# EAGLE schematic WashingMachine (EAGLE 7.1.0)

## Sheet 1 of 5
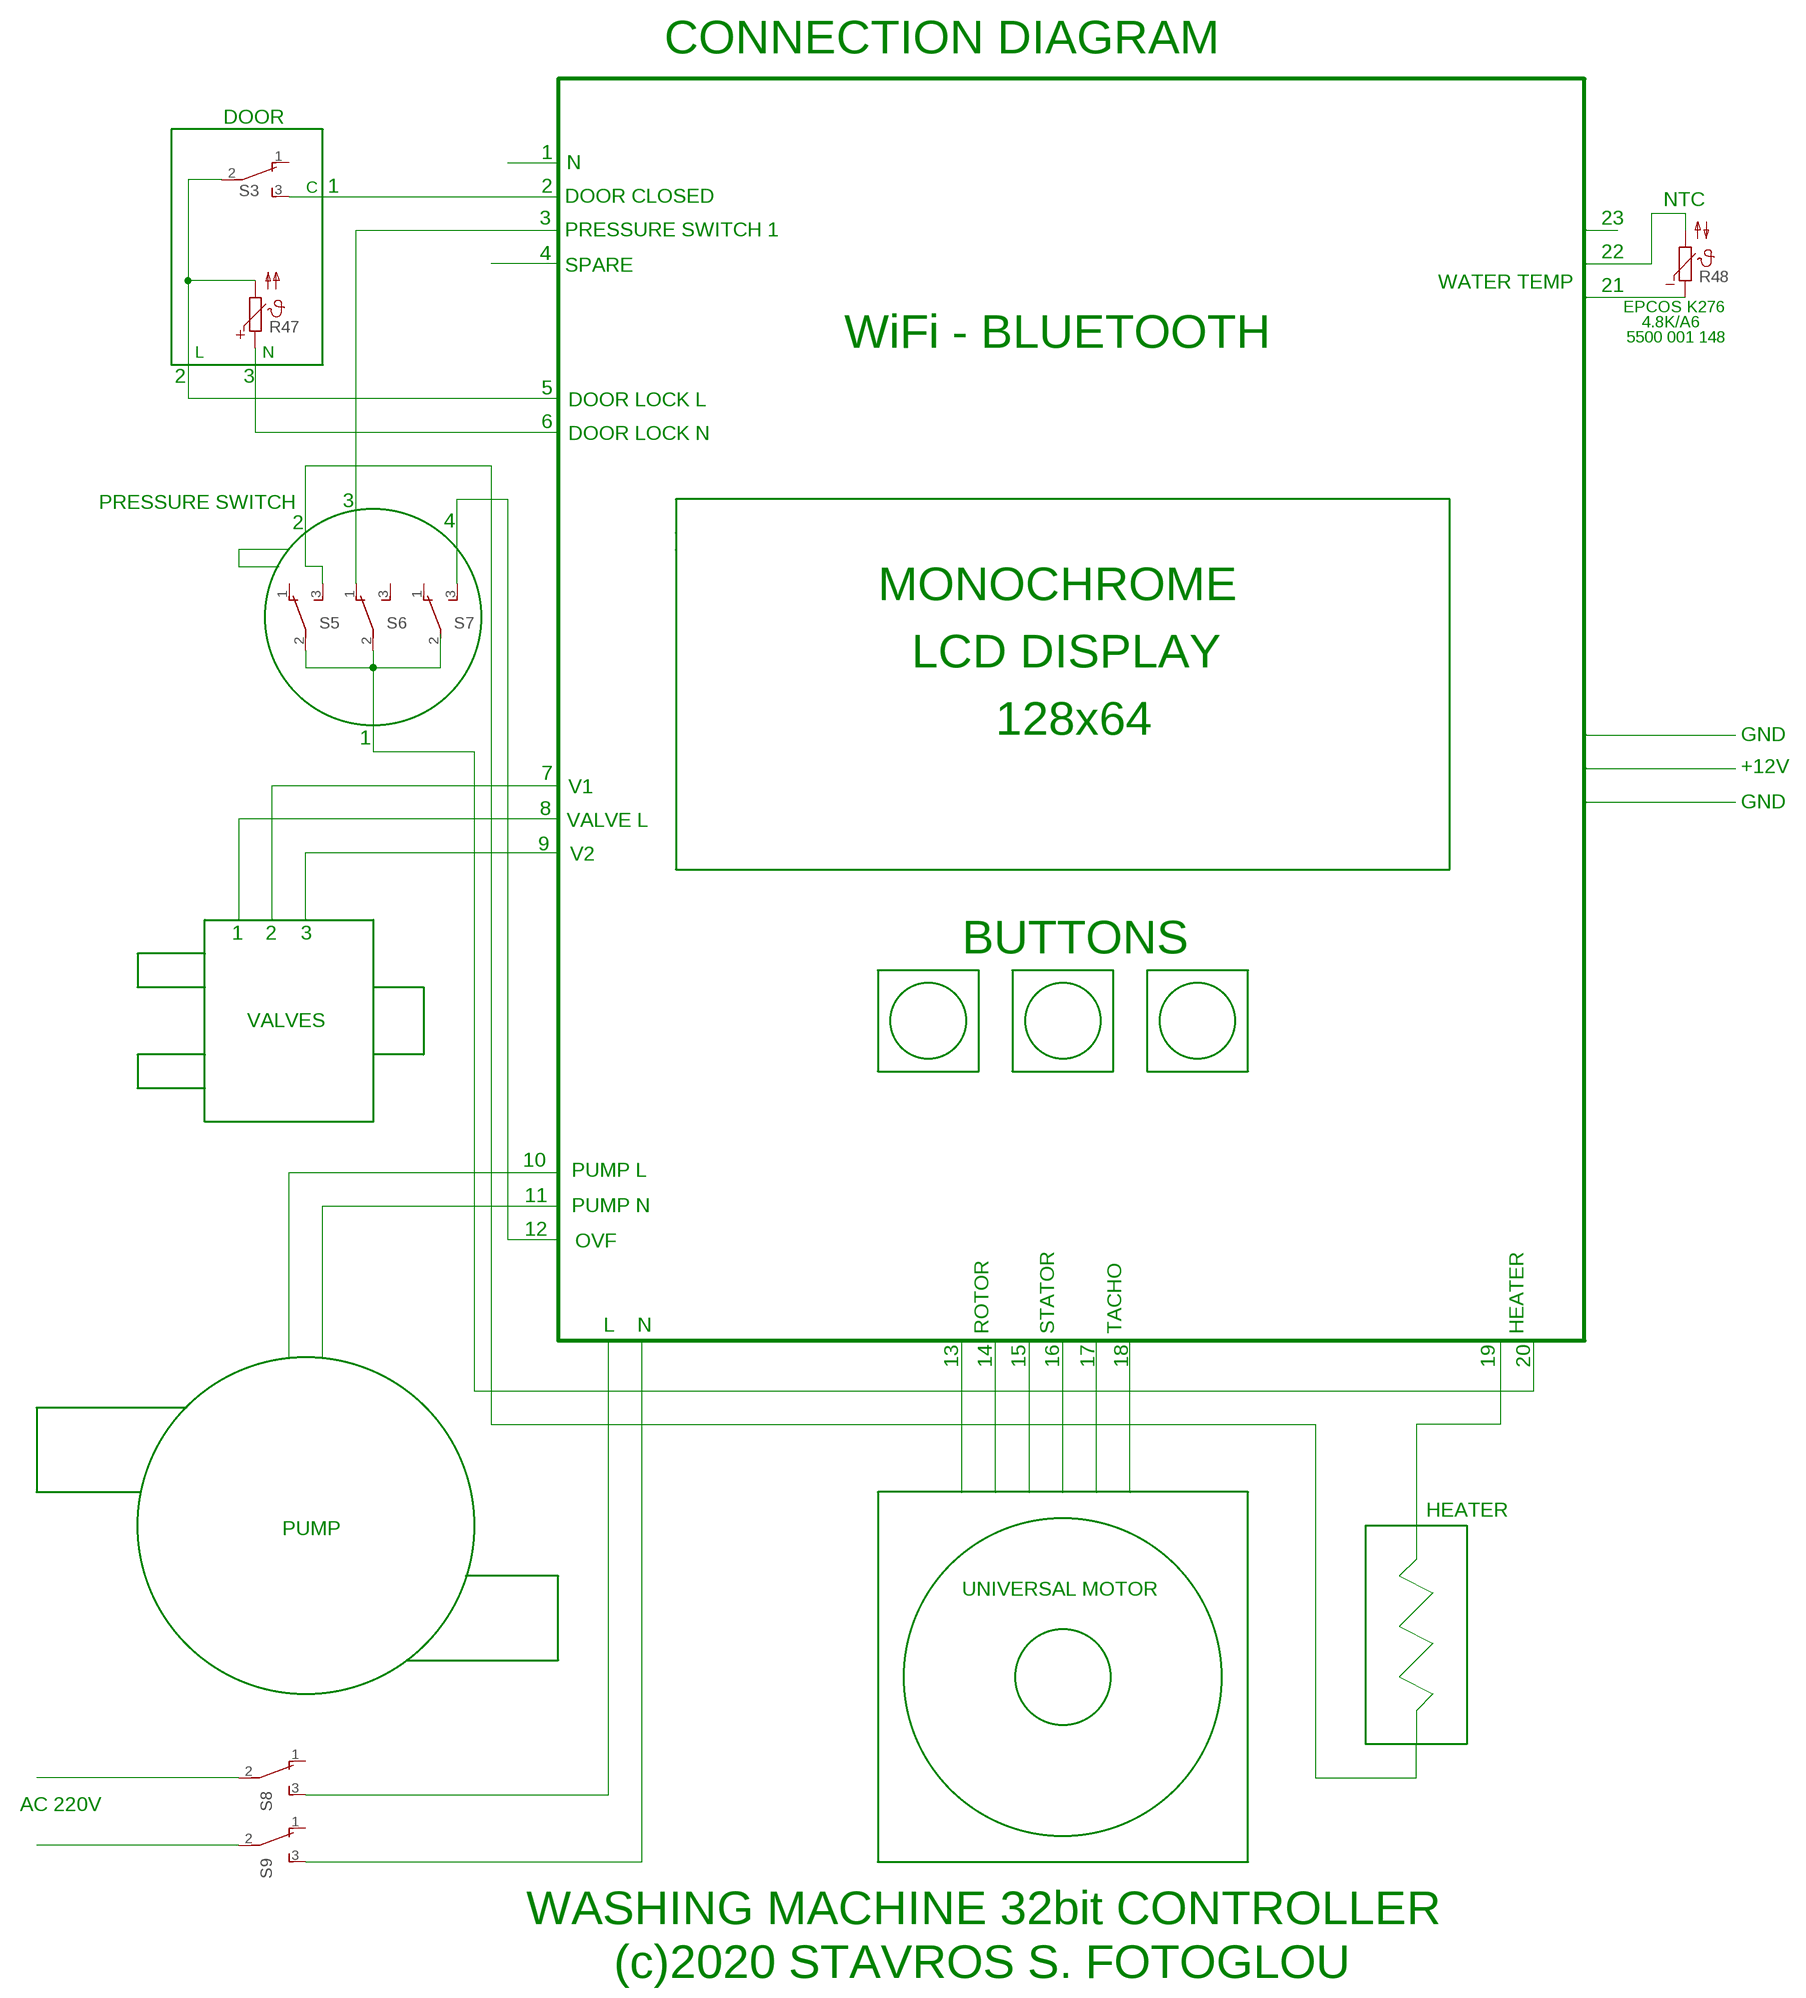
[diagram p0: schematic, sheet 1]

### Parts
R47  PTC679  [P679]
R48  NTC640-9  [N640]
S3  TL36WO  [TL3XWO]
S5  TL36WO  [TL3XWO]
S6  TL36WO  [TL3XWO]
S7  TL36WO  [TL3XWO]
S8  TL36WO  [TL3XWO]
S9  TL36WO  [TL3XWO]

### Nets
N$63: R47.1 R47.2 R48.1 R48.2 S3.2(P) S3.3(S) S5.2(P) S5.3(S) S6.1(O) S6.2(P) S7.2(P) S7.3(S) S8.3(S) S9.3(S)
N$128: S8.2(P)
N$134: S9.2(P)
Unconnected: S3.1(O) S5.1(O) S6.3(S) S7.1(O) S8.1(O) S9.1(O)

### Notes on the sheet
- CONNECTION DIAGRAM
- DOOR
- 1
- N
- C | 1 | 2
- DOOR CLOSED | NTC
- 3 | 23
- PRESSURE SWITCH 1
- 4 | 22
- SPARE
- WATER TEMP | 21
- EPCOS K276
- 4.8K/A6
- 5500 001 148
- WiFi - BLUETOOTH
- L | N
- 2 | 3
- 5
- DOOR LOCK L
- 6
- DOOR LOCK N
- PRESSURE SWITCH | 3
- 2 | 4
- MONOCHROME
- LCD DISPLAY
- 128x64
- 1 | GND
- +12V
- 7
- V1
- GND
- 8
- VALVE L
- 9
- V2
- 1 | 2 | 3
- BUTTONS
- VALVES
- 10
- PUMP L
- 11
- PUMP N
- 12
- OVF
- L | N | ROTOR | STATOR | TACHO | HEATER
- 13 | 14 | 15 | 16 | 17 | 18 | 19 | 20
- HEATER
- PUMP
- UNIVERSAL MOTOR
- AC 220V
- WASHING MACHINE 32bit CONTROLLER
- (c)2020 STAVROS S. FOTOGLOU

## Sheet 2 of 5
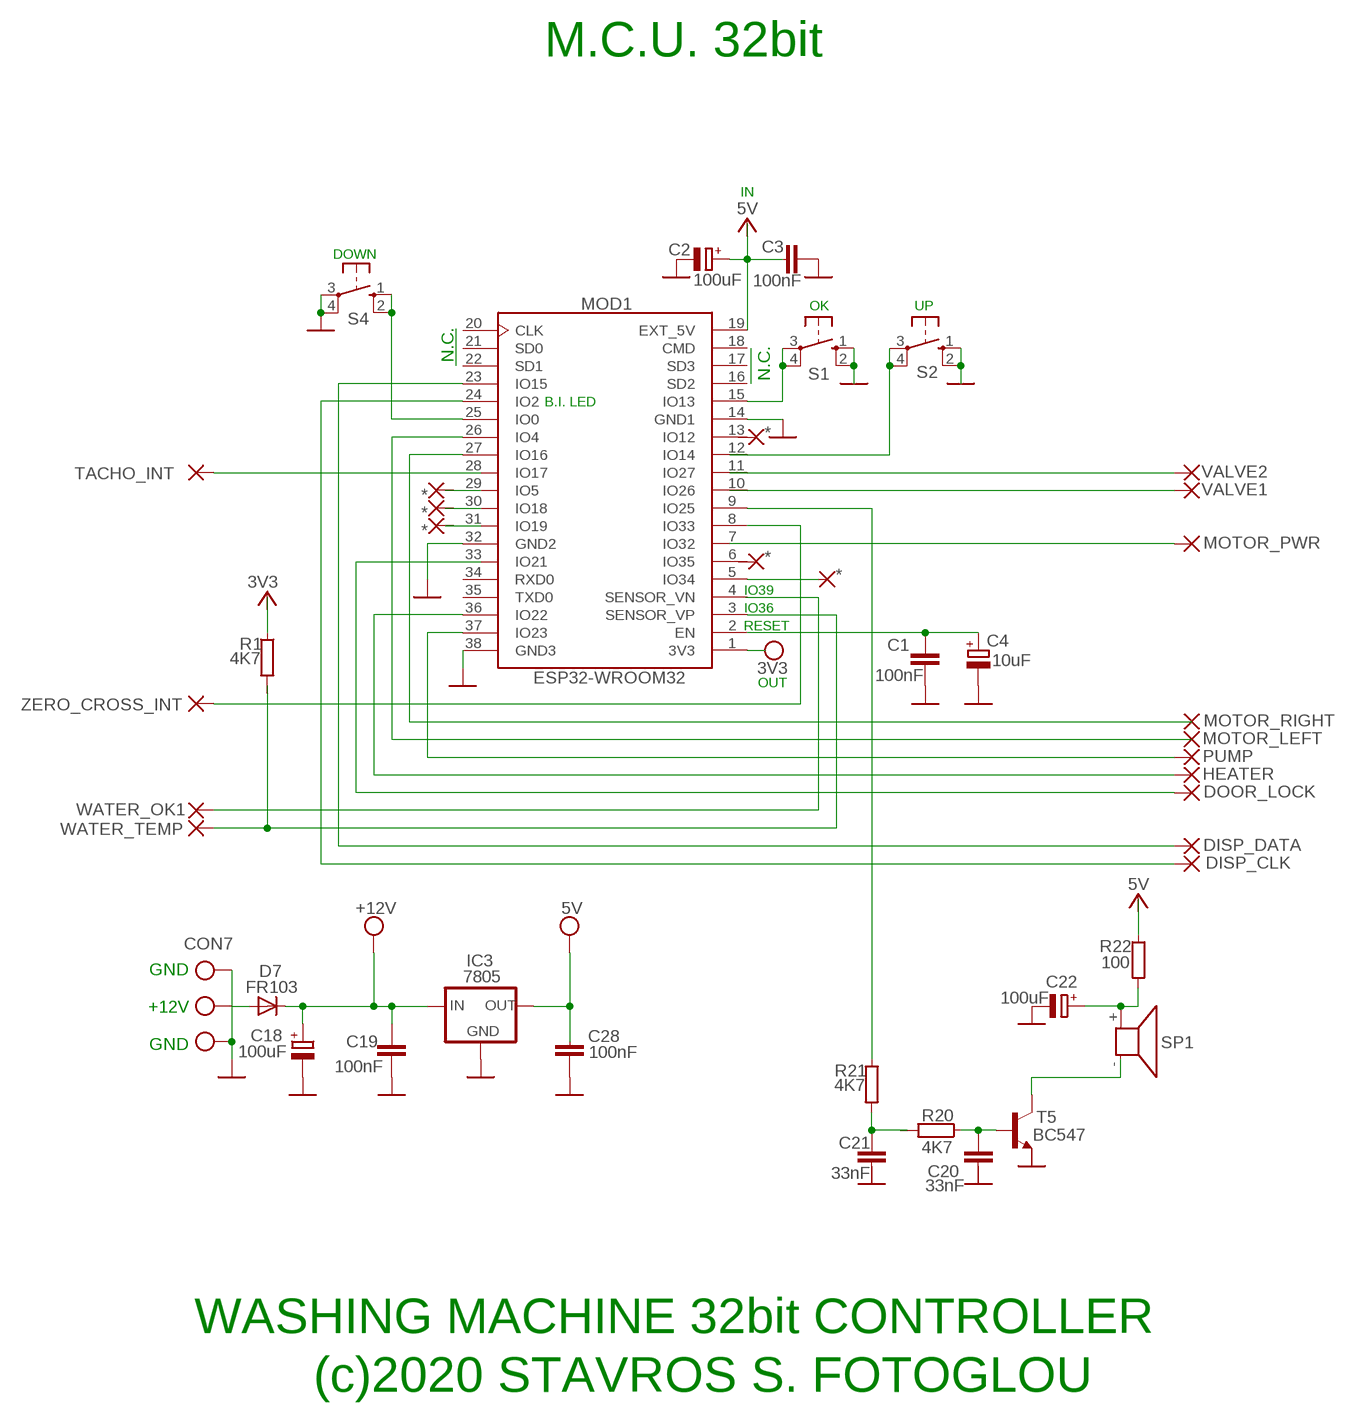
[diagram p1: schematic, sheet 2]

### Parts
C1  100nF  C2.5/2  [C2.5-2]
C2  100uF  CPOL-EUE5-6  [E5-6]
C3  100nF  C2.5/2  [C2.5-2]
C4  10uF  CPOL-EUE5-6  [E5-6]
C18  100uF  CPOL-EUE5-6  [E5-6]
C19  100nF  C2.5/2  [C2.5-2]
C20  33nF  C2.5/2  [C2.5-2]
C21  33nF  C2.5/2  [C2.5-2]
C22  100uF  CPOL-EUE5-6  [E5-6]
C28  100nF  C2.5/2  [C2.5-2]
D7  FR103  1N4004  [DO41-10]
IC3  7805  78XXL  [78XXL]
MOD1  ESP32-WROOM32  ESP32-DEVKITC-32U  [MODULE_ESP32-DEVKITC-32U]
PAD1  MOTOR_RIGHT  1,6/0,8  [1,6/0,8]
PAD2  MOTOR_LEFT  1,6/0,8  [1,6/0,8]
PAD3  TACHO_INT  1,6/0,8  [1,6/0,8]
PAD4  VALVE1  1,6/0,8  [1,6/0,8]
PAD5  VALVE2  1,6/0,8  [1,6/0,8]
PAD6  PUMP  1,6/0,8  [1,6/0,8]
PAD7  HEATER  1,6/0,8  [1,6/0,8]
PAD8  DOOR_LOCK  1,6/0,8  [1,6/0,8]
PAD9  WATER_OK1  1,6/0,8  [1,6/0,8]
PAD10  DISP_DATA  1,6/0,8  [1,6/0,8]
PAD11  DISP_CLK  1,6/0,8  [1,6/0,8]
PAD13  *  1,6/0,8  [1,6/0,8]
PAD14  *  1,6/0,8  [1,6/0,8]
PAD15  *  1,6/0,8  [1,6/0,8]
PAD24  *  1,6/0,8  [1,6/0,8]
PAD25  *  1,6/0,8  [1,6/0,8]
PAD30  WATER_TEMP  1,6/0,8  [1,6/0,8]
PAD31  ZERO_CROSS_INT  1,6/0,8  [1,6/0,8]
PAD32  MOTOR_PWR  1,6/0,8  [1,6/0,8]
PAD34  *  1,6/0,8  [1,6/0,8]
R1  4K7  R-EU_0204_7  [0204/7]
R20  4K7  R-EU_0204_7  [0204/7]
R21  4K7  R-EU_0204_7  [0204/7]
R22  100  R-EU_0204_7  [0204/7]
S1  10-XX  [B3F-10XX]
S2  10-XX  [B3F-10XX]
S4  10-XX  [B3F-10XX]
SP1  AL11P  [AL11P]
T5  BC547  [TO92]
X10  CON7  AK500/3  [AK500/3]

### Nets
GND: C1.2 C2.- C3.1 C4.- C18.- C19.2 C22.- C28.2 IC3.GND MOD1.14(GND1) MOD1.32(GND2) MOD1.38(GND3) S1.1(S) S1.2(S1) S2.1(S) S2.2(S1) S4.3(P) S4.4(P1) X10.1 X10.3 ; also sheet 3,4,5
N$1: MOD1.3(SENSOR_VP) PAD30.1(P)
N$2: MOD1.26(IO4) PAD2.1(P)
N$3: PAD32.1(P)
N$4: MOD1.10(IO26) PAD4.1(P)
N$5: MOD1.27(IO16) PAD1.1(P)
N$6: PAD3.1(P)
N$7: MOD1.30(IO18)
N$8: MOD1.8(IO33) PAD31.1(P)
N$11: PAD5.1(P)
N$12: PAD9.1(P)
N$13: MOD1.37(IO23) PAD6.1(P)
N$14: MOD1.36(IO22) PAD7.1(P)
N$15: PAD8.1(P)
N$16: C1.1 C4.+ MOD1.2(EN)
N$19: MOD1.23(IO15) PAD10.1(P)
N$20: MOD1.24(IO2) PAD11.1(P)
N$21: MOD1.5(IO34)
N$38: MOD1.15(IO13) S1.3(P) S1.4(P1)
N$39: S2.3(P) S2.4(P1)
N$87: MOD1.25(IO0) S4.1(S) S4.2(S1)
N$90: D7.A X10.2
N$91: C20.1 R20.1 T5.2(B)
N$92: C21.1 R20.2 R21.2
N$93: SP1.- T5.3(C)
N$94: MOD1.9(IO25) R21.1
N$95: C22.+ R22.2 SP1.+
N$125: C2.+ C3.2 MOD1.19(EXT_5V)
VCC: C18.+ C19.1 C28.1 D7.C IC3.IN IC3.OUT MOD1.1(3V3) ; supply symbol labelled +12V, 5V, 3V3 ; also sheet 3,4,5
Unconnected: C20.2 C21.2 MOD1.4(SENSOR_VN) MOD1.6(IO35) MOD1.7(IO32) MOD1.11(IO27) MOD1.12(IO14) MOD1.13(IO12) MOD1.16(SD2) MOD1.17(SD3) MOD1.18(CMD) MOD1.20(CLK) MOD1.21(SD0) MOD1.22(SD1) MOD1.28(IO17) MOD1.29(IO5) MOD1.31(IO19) MOD1.33(IO21) MOD1.34(RXD0) MOD1.35(TXD0) PAD13.1(P) PAD14.1(P) PAD15.1(P) PAD24.1(P) PAD25.1(P) PAD34.1(P) R1.1 R1.2 R22.1 T5.1(E)

### Notes on the sheet
- M.C.U. 32bit
- IN
- DOWN
- OK | UP
- N.C.
- N.C.
- B.I. LED
- IO39
- IO36
- RESET
- OUT
- GND
- +12V
- GND
- WASHING MACHINE 32bit CONTROLLER
- (c)2020 STAVROS S. FOTOGLOU

## Sheet 3 of 5
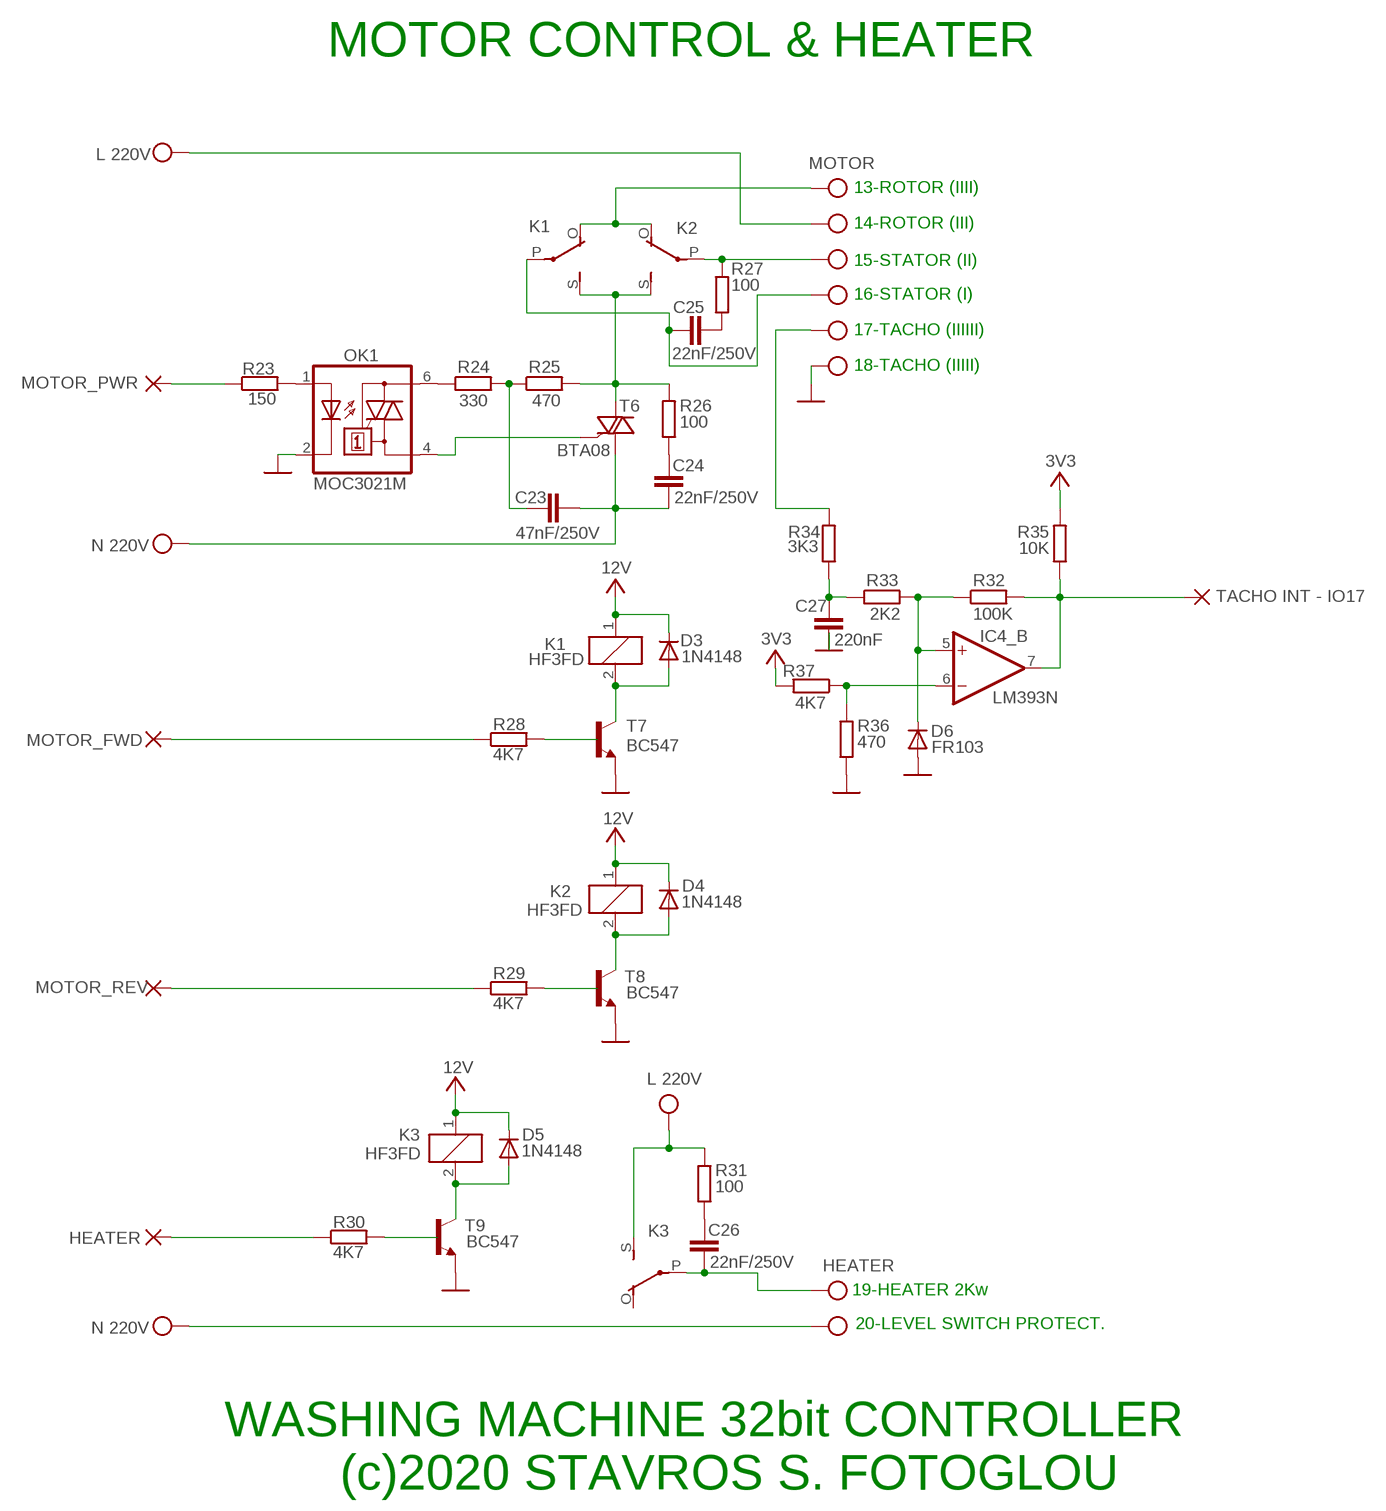
[diagram p2: schematic, sheet 3]

### Parts
C23  47nF/250V  C-EU050-025X075  [C050-025X075]
C24  22nF/250V  C-EU050-025X075  [C050-025X075]
C25  22nF/250V  C-EU050-025X075  [C050-025X075]
C26  22nF/250V  C-EU050-025X075  [C050-025X075]
C27  220nF  C-EU050-025X075  [C050-025X075]
D3  1N4148  1N4148DO35-10  [DO35-10]
D4  1N4148  1N4148DO35-10  [DO35-10]
D5  1N4148  1N4148DO35-10  [DO35-10]
D6  FR103  1N4004  [DO41-10]
IC4_  LM393N  [DIL08]
K1  HF3FD  G5L  [G5LE]
K2  HF3FD  G5L  [G5LE]
K3  HF3FD  G5L  [G5LE]
OK1  MOC3021M  [DIL06]
PAD36  MOTOR_PWR  2,15/1,0  [2,15/1,0]
PAD37  MOTOR_FWD  2,15/1,0  [2,15/1,0]
PAD38  MOTOR_REV  2,15/1,0  [2,15/1,0]
PAD39  HEATER  2,15/1,0  [2,15/1,0]
PAD40  TACHO INT - IO17  2,15/1,0  [2,15/1,0]
R23  150  R0204/7  [0204/7]
R24  330  R0204/7  [0204/7]
R25  470  R0204/7  [0204/7]
R26  100  R0204/7  [0204/7]
R27  100  R0204/7  [0204/7]
R28  4K7  R0204/7  [0204/7]
R29  4K7  R0204/7  [0204/7]
R30  4K7  R0204/7  [0204/7]
R31  100  R0204/7  [0204/7]
R32  100K  R0204/7  [0204/7]
R33  2K2  R0204/7  [0204/7]
R34  3K3  R0204/7  [0204/7]
R35  10K  R0204/7  [0204/7]
R36  470  R0204/7  [0204/7]
R37  4K7  R0204/7  [0204/7]
T6  BTA08  BT136  [TO220AB]
T7  BC547  [TO92]
T8  BC547  [TO92]
T9  BC547  [TO92]
X1  MOTOR  AK500/6  [AK500/6]
X2  HEATER  AK500/2  [AK500/2]

### Nets
GND: C27.1 D6.A OK1.2(C) R36.1 T7.1(E) T8.1(E) T9.1(E) X1.1 ; also sheet 2,4,5
N$97: OK1.1(A) R23.2
N$98: PAD36.1(P) R23.1
N$99: OK1.6(A2) R24.1
N$100: C23.1 R24.2 R25.1
N$101: OK1.4(A1) T6.3(G)
N$102: K1.S(2:S) K2.S(2:S) R25.2 R26.2 T6.2(A2)
N$103: K2.P(2:P) R27.2 X1.4
N$104: C24.2 R26.1
N$105: C25.1 K1.P(2:P) X1.3
N$106: K1.O(2:O) K2.O(2:O) X1.6
N$107: C25.2 R27.1
N$108: PAD37.1(P) R28.1
N$109: R28.2 T7.2(B)
N$110: D3.A K1.2 T7.3(C)
N$111: PAD39.1(P) R30.1
N$112: PAD38.1(P) R29.1
N$113: R29.2 T8.2(B)
N$114: D4.A K2.2 T8.3(C)
N$115: R30.2 T9.2(B)
N$116: D5.A K3.2 T9.3(C)
N$117: C26.2 R31.1
N$118: C26.1 K3.P(2:P) X2.2
N$119: D6.C IC4_.5(B:+IN) R32.1 R33.2
N$120: IC4_.7(B:OUT) PAD40.1(P) R32.2 R35.1
N$121: C27.2 R33.1 R34.1
N$122: IC4_.6(B:-IN) R36.2 R37.1
N$123: R34.2 X1.2
VCC: C23.2 C24.1 D3.C D4.C D5.C K1.1 K2.1 K3.1 K3.S(2:S) R31.2 R35.2 R37.2 T6.1(A1) X1.5 X2.1 ; supply symbol labelled N 220V, L 220V, 12V, 3V3 ; also sheet 2,4,5
Unconnected: IC4_.1(A:OUT) IC4_.2(A:-IN) IC4_.3(A:+IN) K3.O(2:O)

### Notes on the sheet
- MOTOR CONTROL & HEATER
- 13-ROTOR (IIII)
- 14-ROTOR (III)
- 15-STATOR (II)
- 16-STATOR (I)
- 17-TACHO (IIIIII)
- 18-TACHO (IIIII)
- 19-HEATER 2Kw
- 20-LEVEL SWITCH PROTECT.
- WASHING MACHINE 32bit CONTROLLER
- (c)2020 STAVROS S. FOTOGLOU

## Sheet 4 of 5
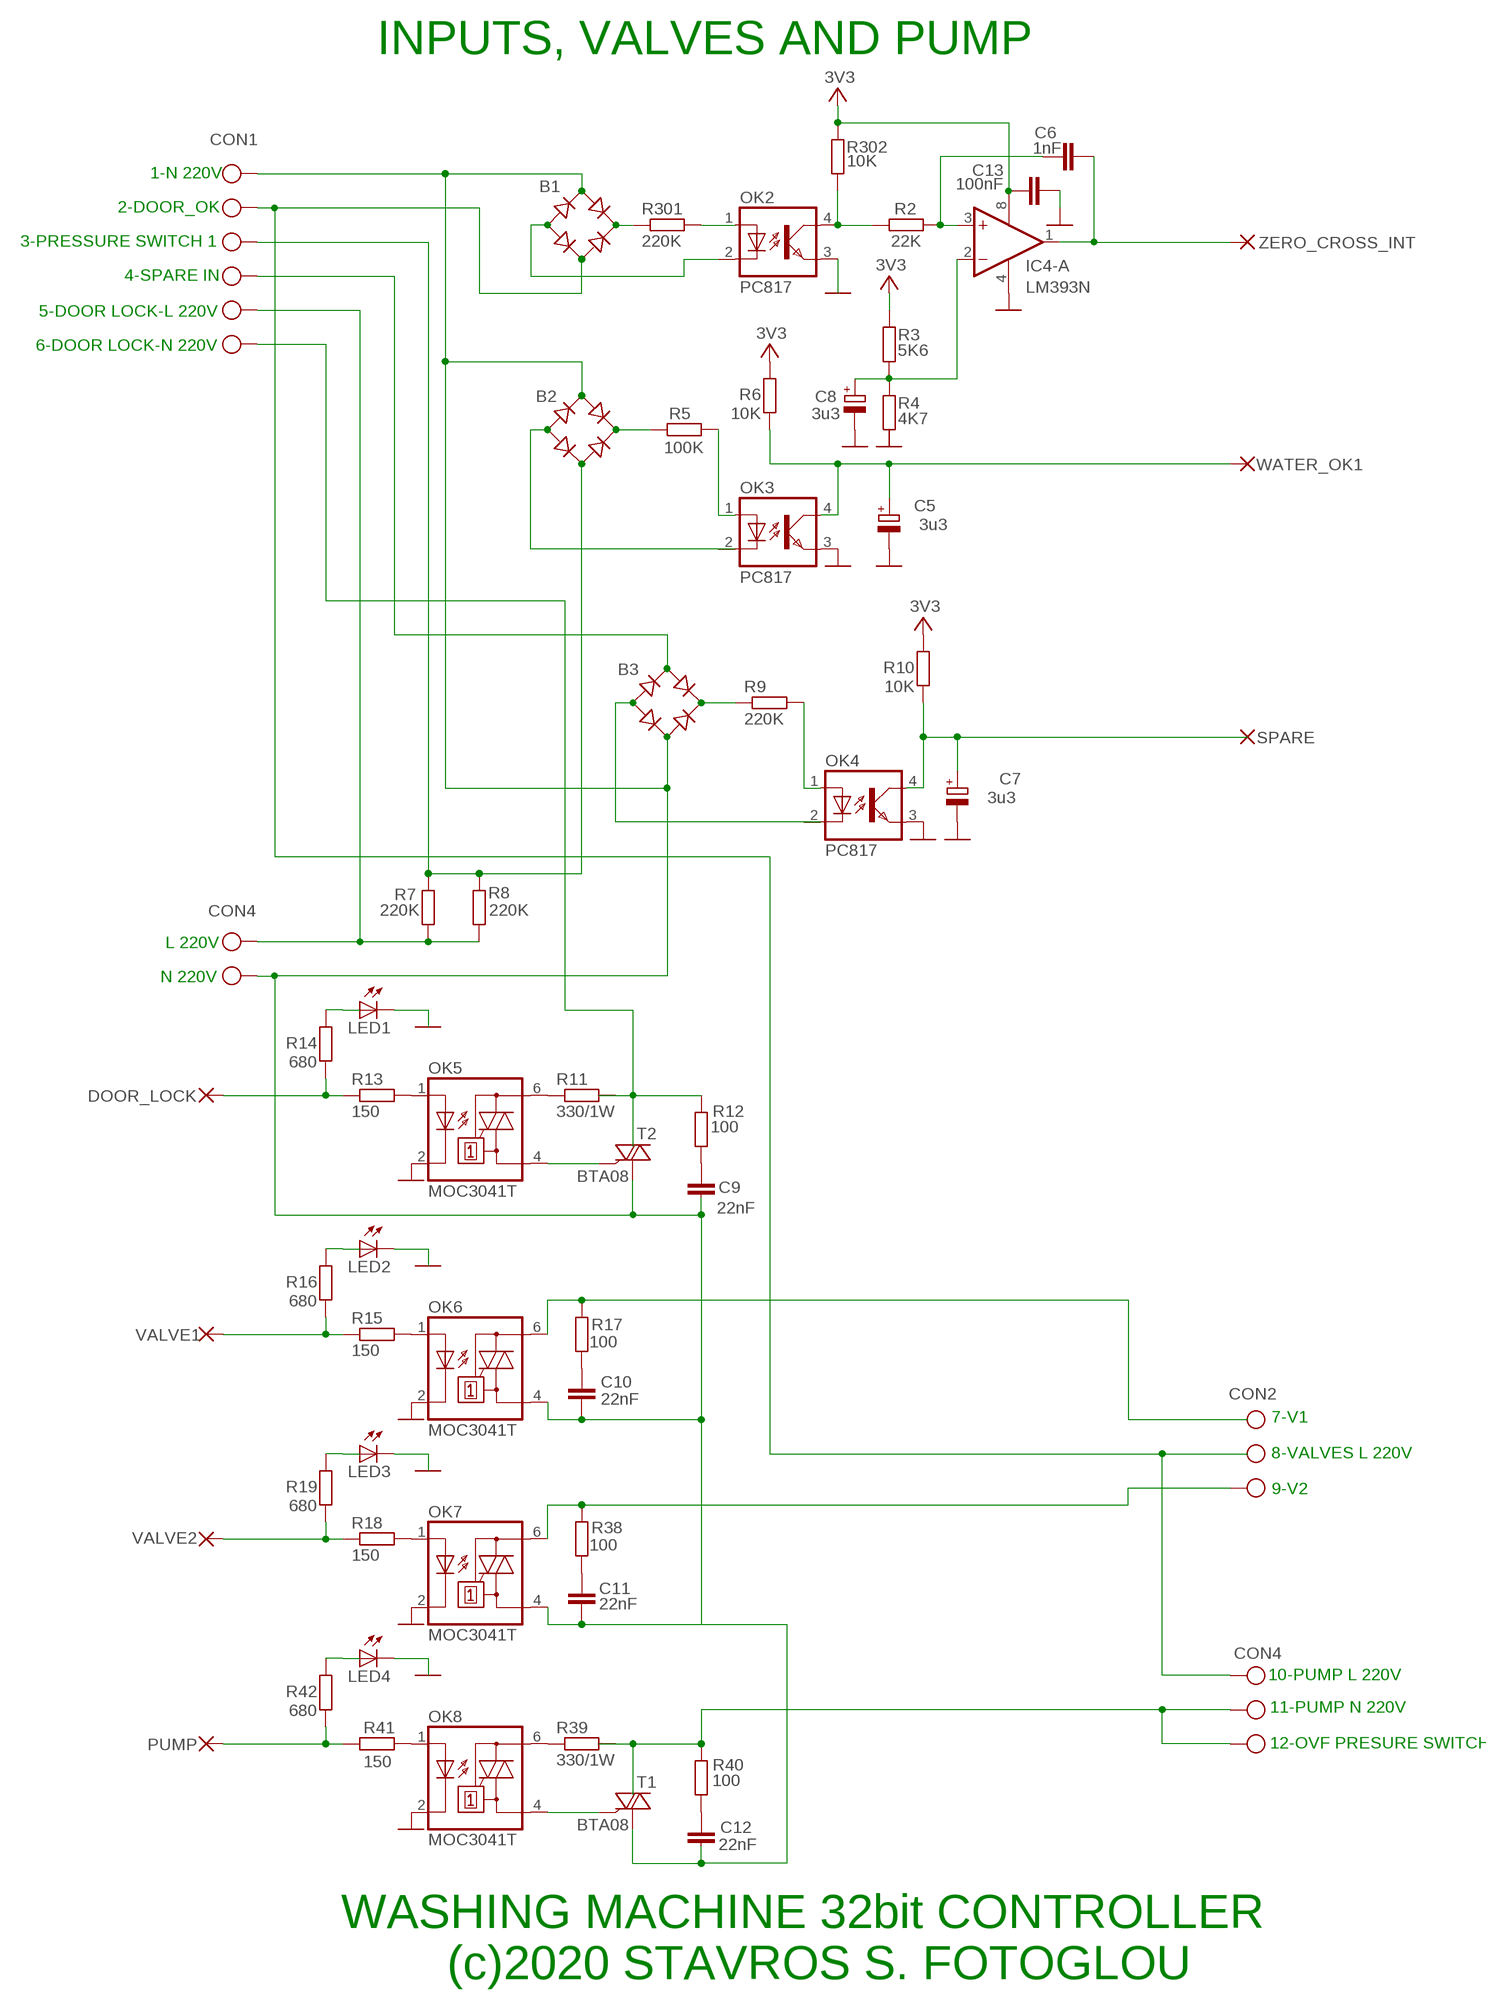
[diagram p3: schematic, sheet 4]

### Parts
B1  DBDB101G  [DB]
B2  DBDB101G  [DB]
B3  DBDB101G  [DB]
C5  3u3  CPOL-EUE5-6  [E5-6]
C6  1nF  C-EU050-025X075  [C050-025X075]
C7  3u3  CPOL-EUE5-6  [E5-6]
C8  3u3  CPOL-EUE5-6  [E5-6]
C9  22nF  C-EU050-025X075  [C050-025X075]
C10  22nF  C-EU050-025X075  [C050-025X075]
C11  22nF  C-EU050-025X075  [C050-025X075]
C12  22nF  C-EU050-025X075  [C050-025X075]
C13  100nF  C-EU050-025X075  [C050-025X075]
IC4-  LM393N  [DIL08]
LED1  LED_ELD260  [LED_LD260]
LED2  LED_ELD260  [LED_LD260]
LED3  LED_ELD260  [LED_LD260]
LED4  LED_ELD260  [LED_LD260]
OK2  PC817  [DIL04]
OK3  PC817  [DIL04]
OK4  PC817  [DIL04]
OK5  MOC3041T  [DIL06B]
OK6  MOC3041T  [DIL06B]
OK7  MOC3041T  [DIL06B]
OK8  MOC3041T  [DIL06B]
PAD12  DOOR_LOCK  1,6/0,8  [1,6/0,8]
PAD16  ZERO_CROSS_INT  1,6/0,8  [1,6/0,8]
PAD17  WATER_OK1  1,6/0,8  [1,6/0,8]
PAD18  SPARE  1,6/0,8  [1,6/0,8]
PAD19  VALVE1  1,6/0,8  [1,6/0,8]
PAD20  VALVE2  1,6/0,8  [1,6/0,8]
PAD21  PUMP  1,6/0,8  [1,6/0,8]
R2  22K  R-EU_0204_7  [0204/7]
R3  5K6  R-EU_0204_7  [0204/7]
R4  4K7  R-EU_0204_7  [0204/7]
R5  100K  R-EU_0204_7  [0204/7]
R6  10K  R-EU_0204_7  [0204/7]
R7  220K  R-EU_0204_7  [0204/7]
R8  220K  R-EU_0204_7  [0204/7]
R9  220K  R-EU_0204_7  [0204/7]
R10  10K  R-EU_0204_7  [0204/7]
R11  330/1W  R-EU_0204_7  [0204/7]
R12  100  R-EU_0204_7  [0204/7]
R13  150  R-EU_0204_7  [0204/7]
R14  680  R-EU_0204_7  [0204/7]
R15  150  R-EU_0204_7  [0204/7]
R16  680  R-EU_0204_7  [0204/7]
R17  100  R-EU_0204_7  [0204/7]
R18  150  R-EU_0204_7  [0204/7]
R19  680  R-EU_0204_7  [0204/7]
R38  100  R-EU_0204_7  [0204/7]
R39  330/1W  R-EU_0204_7  [0204/7]
R40  100  R-EU_0204_7  [0204/7]
R41  150  R-EU_0204_7  [0204/7]
R42  680  R-EU_0204_7  [0204/7]
R301  220K  R-EU_0204_7  [0204/7]
R302  10K  R-EU_0204_7  [0204/7]
T1  BTA08  BT136  [TO220AB]
T2  BTA08  BT136  [TO220AB]
X3  CON1  AK500/2  [AK500/2]
X4  AK500/2  [AK500/2]
X5  CON4  AK500/2  [AK500/2]
X6  AK500/2  [AK500/2]
X7  CON2  AK500/3  [AK500/3]
X8  CON4  AK500/3  [AK500/3]

### Nets
GND: C5.- C7.- C8.- C13.2 IC4-.4(P:V-) OK3.3(EMIT) OK4.3(EMIT) OK5.2(C) OK6.2(C) OK7.2(C) OK8.2(C) ; also sheet 2,3,5
N$18: B1.+ R301.1
N$25: R301.2
N$26: B1.- OK2.2(C)
N$27: OK2.3(EMIT)
N$28: OK2.4(COL) R2.1 R302.1
N$29: B1.AC1 B2.AC1 B3.AC2 C9.1 C10.1 C11.1 C12.1 OK6.4(A1) OK7.4(A1) T1.1(A1) T2.1(A1) X3.1 X5.2
N$30: B1.AC2 X3.2 X8.3
N$31: C6.1 IC4-.3(A:+IN) R2.2
N$32: C6.2 IC4-.1(A:OUT) PAD16.1(P)
N$33: OK6.6(A2) R17.2 X7.3
N$34: C8.+ IC4-.2(A:-IN) R3.1 R4.2
N$35: B2.+ R5.1
N$36: OK3.1(A) R5.2
N$37: B2.-
N$40: C5.+ OK3.4(COL) PAD17.1(P) R6.1
N$41: B3.AC1 X4.2
N$42: B2.AC2 R7.2 R8.2 X4.1
N$43: R7.1 R8.1 X5.1 X6.1
N$44: B3.+ R9.1
N$45: OK5.4(A1) T2.3(G)
N$46: OK4.1(A) R9.2
N$47: B3.-
N$48: C7.+ OK4.4(COL) PAD18.1(P) R10.1
N$50: OK5.6(A2) R11.1
N$51: R11.2 R12.2 T2.2(A2) X6.2
N$52: C9.2 R12.1
N$53: OK5.1(A) R13.2
N$54: PAD12.1(P) R13.1 R14.1
N$55: LED1.A R14.2
N$56: LED1.K(C) LED2.K(C) LED3.K(C) LED4.K(C)
N$57: OK7.1(A) R18.2
N$58: OK6.1(A) R15.2
N$59: PAD19.1(P) R15.1 R16.1
N$60: LED2.A R16.2
N$61: C10.2 R17.1
N$62: PAD20.1(P) R18.1 R19.1
N$64: LED3.A R19.2
N$65: C11.2 R38.1
N$67: OK7.6(A2) R38.2 X7.1
N$68: OK8.4(A1) T1.3(G)
N$69: OK8.6(A2) R39.1
N$70: R39.2 R40.2 T1.2(A2) X8.1 X8.2
N$71: C12.2 R40.1
N$72: OK8.1(A) R41.2
N$73: PAD21.1(P) R41.1 R42.1
N$74: LED4.A R42.2
VCC: C13.1 IC4-.8(P:V+) R3.2 R6.2 R10.2 R302.2 ; supply symbol labelled 3V3 ; also sheet 2,3,5
Unconnected: IC4-.5(B:+IN) IC4-.6(B:-IN) IC4-.7(B:OUT) OK2.1(A) OK3.2(C) OK4.2(C) R4.1 X7.2

### Notes on the sheet
- INPUTS, VALVES AND PUMP
- 1-N 220V
- 2-DOOR_OK
- 3-PRESSURE SWITCH 1
- 4-SPARE IN
- 5-DOOR LOCK-L 220V
- 6-DOOR LOCK-N 220V
- L 220V
- N 220V
- 7-V1
- 8-VALVES L 220V
- 9-V2
- 10-PUMP L 220V
- 11-PUMP N 220V
- 12-OVF PRESURE SWITCH
- WASHING MACHINE 32bit CONTROLLER
- (c)2020 STAVROS S. FOTOGLOU

## Sheet 5 of 5
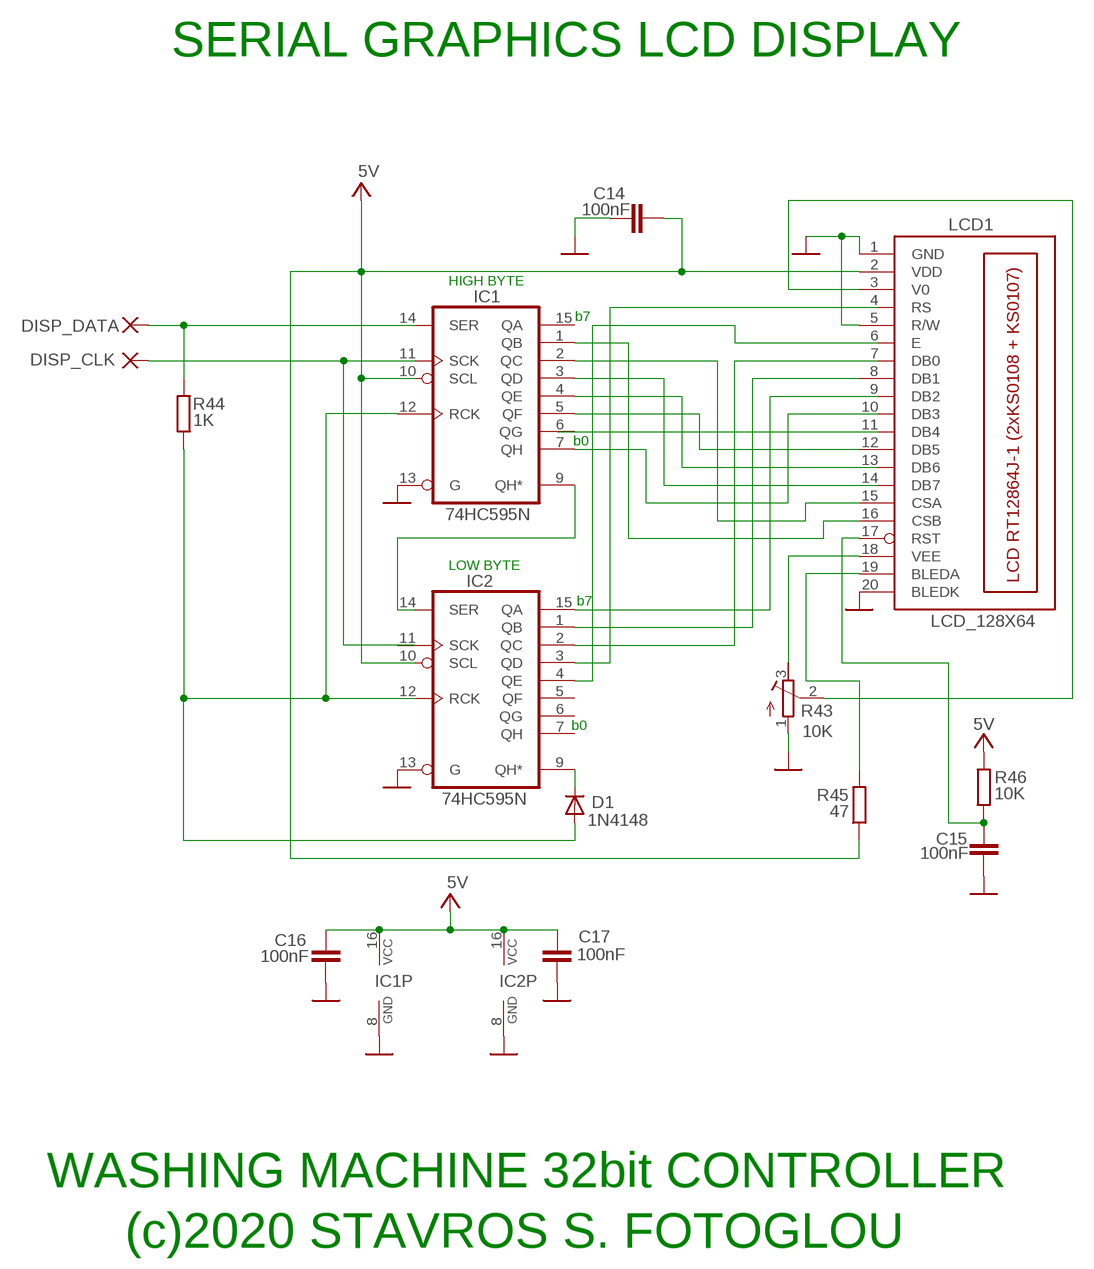
[diagram p4: schematic, sheet 5]

### Parts
C14  100nF  C-EU050-025X075  [C050-025X075]
C15  100nF  C-EU050-025X075  [C050-025X075]
C16  100nF  C-EU050-025X075  [C050-025X075]
C17  100nF  C-EU050-025X075  [C050-025X075]
D1  1N4148  1N4148DO35-10  [DO35-10]
IC1  74HC595N  [DIL16]
IC2  74HC595N  [DIL16]
LCD1  LCD_128X64  LCD_128X64_SIL  [ABG128064J]
PAD22  DISP_CLK  1,6/0,8  [1,6/0,8]
PAD23  DISP_DATA  1,6/0,8  [1,6/0,8]
R43  10K  R-TRIMM3339P  [RTRIM3339P]
R44  1K  R-EU_0204_7  [0204/7]
R45  47  R-EU_0204_7  [0204/7]
R46  10K  R-EU_0204_7  [0204/7]

### Nets
GND: C14.1 C15.1 C16.1 C17.1 IC1.8(GND) IC1.13(G) IC2.8(GND) IC2.13(G) LCD1.1(GND) LCD1.5(R/W) LCD1.20(BLEDK) R43.1(E) ; also sheet 2,3,4
N$49: IC1.14(SER) PAD23.1(P) R44.2
N$66: IC1.11(SCK) IC2.11(SCK) PAD22.1(P)
N$75: IC1.9(QH*) IC2.14(SER)
N$76: LCD1.18(VEE) R43.3(A)
N$77: D1.A IC1.12(RCK) IC2.12(RCK) R44.1
N$78: IC1.6(QG) LCD1.11(DB4)
N$79: IC1.5(QF) LCD1.12(DB5)
N$80: IC1.4(QE) LCD1.13(DB6)
N$81: IC1.3(QD) LCD1.14(DB7)
N$82: IC1.7(QH) LCD1.10(DB3)
N$83: IC2.15(QA) LCD1.9(DB2)
N$84: IC2.1(QB) LCD1.8(DB1)
N$85: IC2.2(QC) LCD1.7(DB0)
N$86: C15.2 LCD1.17(RST) R46.1
N$129: IC1.2(QC) LCD1.15(CSA)
N$130: IC1.1(QB) LCD1.16(CSB)
N$131: IC2.3(QD) LCD1.4(RS)
N$132: IC2.4(QE) LCD1.6(E)
N$133: LCD1.3(V0) R43.2(S)
N$135: D1.C IC2.9(QH*)
N$137: LCD1.19(BLEDA) R45.2
VCC: C14.2 C16.2 C17.2 IC1.10(SCL) IC1.16(VCC) IC2.10(SCL) IC2.16(VCC) LCD1.2(VDD) R45.1 R46.2 ; supply symbol labelled 5V ; also sheet 2,3,4
Unconnected: IC1.15(QA) IC2.5(QF) IC2.6(QG) IC2.7(QH)

### Notes on the sheet
- SERIAL GRAPHICS LCD DISPLAY
- HIGH BYTE
- b7
- b0
- LOW BYTE
- b7
- b0
- WASHING MACHINE 32bit CONTROLLER
- (c)2020 STAVROS S. FOTOGLOU

## Power pins joined to a net without a drawn wire
V+: IC4_.8(P:V+)
V-: IC4_.4(P:V-)

## Library data of the parts
B1-B3 = rectifier:DB?*G: Single Phase 1.0 AMP Glass Passivated Bridge Rectifier Taiwan Semiconductor Co.,Ltd. - TSC Source: http://www.taiwansemi.com/TSCbig5/ezcatfiles/cust/img/img/db101g.pdf http://www.ts.com.tw/db/pictures/modules/PDT/PDT060207001/DBLS201G.pdf
C1 C3 C19-C21 C28 = capacitor-wima:C: CAPACITOR naming: grid - package width
C2 C4 C5 C7 C8 C18 C22 = rcl:CPOL-EU: POLARIZED CAPACITOR, European symbol
C6 C9-C17 C23-C27 = rcl:C-EU: CAPACITOR, European symbol
D1 D3-D5 = diode:1N4148: DIODE high speed (Philips)
D6 D7 = diode:1N4004: DIODE general purpose rectifier, 1 A
IC1 IC2 = 74xx-eu:74*595: 8-bit SHIFT REGISTER, output latch
IC3 = v-reg:78XXL: VOLTAGE REGULATOR
IC4- IC4_ = linear:LM393: COMPARATOR
K1-K3 = relay:G5L: RELAY 1 x switch, 10 A/120 V AC, 8 A/30 V ADC, Omron; OC_FARNELL: unknown; OC_NEWARK: unknown
LCD1 = lcd_128x64_led_backlight:LCD_128X64_SIL
LED1-LED4 = eagle-ltspice:LED_E: LED Source: http://www.osram.convergy.de Source: www.luxeon.com Source: www.kingbright.com; SPICEMODEL: NONE; SPICEPREFIX: D; SPICETYPE: diode
MOD1 = ESP32-DEVKITC-32U:ESP32-DEVKITC-32U: ESP32-DEVKITC; AVAILABILITY: Unavailable; DESCRIPTION: - Transceiver; 802.11 b/g/n (Wi-Fi, WiFi, WLAN), Bluetooth® Smart Ready 4.x Dual Mode For Use With ESP32-WROOM-32UE; MF: Espressif Systems; MP: ESP32-DEVKITC-32U; PACKAGE: None; PRICE: None
OK1 = optocoupler:MOC30*M: RANDOM-PHASE OPTOISOLATORS TRIAC DRIVER OUTPUT Source: http://www.fairchildsemi.com MOC3020-M.pdf; MF: FAIRCHILD SEMICONDUCTOR; MPN: MOC3021-M; OC_FARNELL: 1021365; OC_NEWARK: 95B7895
OK2-OK4 = optocoupler:PC817: SHARP OPTO COUPLER; MPN: PC817X4J000F; OC_FARNELL: 9707727; OC_NEWARK: 97K7059
OK5-OK8 = optocoupler:MOC30*: 6-Pin DIP Zero-Cross Optoisolators Triac Driver Output (250/400 Volt Peak) Source: Data sheet <http://www.fairchildsemi.com/ds/MO/MOC3031M.pdf> The old path of data sheet not more available 2013-05-06.; OC_FARNELL: unknown; OC_NEWARK: unknown
PAD1-PAD25 PAD30-PAD32 PAD34 = wirepad:1,6/0,8: THROUGH-HOLE PAD
PAD36-PAD40 = wirepad:2,15/1,0: THROUGH-HOLE PAD
R1-R22 R38-R42 R44-R46 R301 R302 = resistor:R-EU_: RESISTOR, European symbol; SPICEPREFIX: R
R23-R37 = eagle-ltspice:R: RESISTOR, European symbol; SPICEMODEL: NONE; SPICEPREFIX: R
R43 = resistor:R-TRIMM: Trimm resistor
R47 = ptc-ntc:PTC679: PHILIPS PTC; OC_FARNELL: unknown; OC_NEWARK: unknown
R48 = ptc-ntc:NTC640-9: PHILIPS NTC; OC_FARNELL: unknown; OC_NEWARK: unknown
S1 S2 S4 = switch-omron:10-XX: OMRON SWITCH; MPN: B3F-1000; OC_FARNELL: 176432; OC_NEWARK: 36M3542
S3 S5-S9 = switch:TL36WO: TINY SWITCH ON - ON Source: http://www2.produktinfo.conrad.com/datenblaetter/700000-724999/705152-da-01-de-Subminiaturschalter_TL_36WO.pdf
SP1 = buzzer:AL11P: SPEAKER Source: Buerklin; OC_FARNELL: unknown; OC_NEWARK: unknown
T1 T2 T6 = triac:BT136: Triac BT136 series E sensitive gate Source: http://www.nxp.com/acrobat_download/datasheets/BT136_SERIES_E_2.pdf
T5 T7-T9 = transistor:BC547: NPN TRANSISTOR
X1 = con-ptr500:AK500/6: CONNECTOR; OC_FARNELL: unknown; OC_NEWARK: unknown
X2-X6 = con-ptr500:AK500/2: CONNECTOR; OC_FARNELL: unknown; OC_NEWARK: unknown
X7 X8 X10 = con-ptr500:AK500/3: CONNECTOR; OC_FARNELL: unknown; OC_NEWARK: unknown